# Altium schematic sheet M2maleDouble_M2female.SchDoc
size A4; SheetNumber: 1; SheetTotal: 1
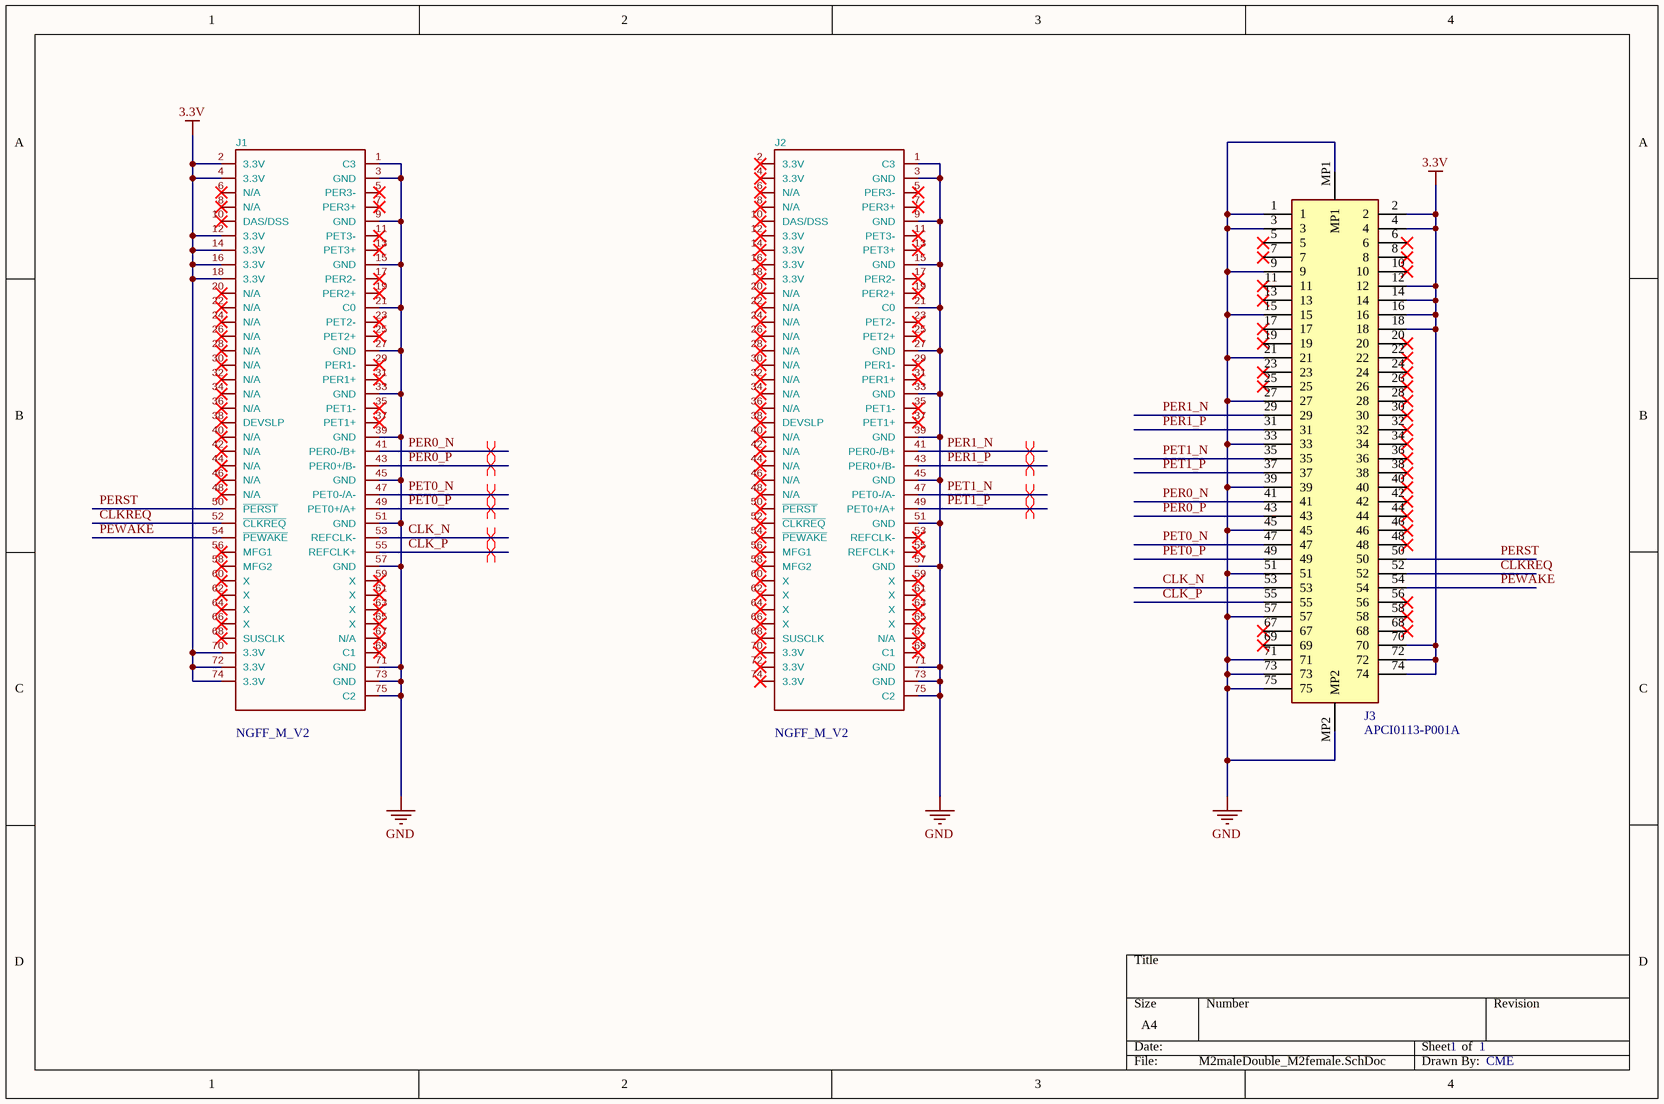
[diagram p0: M2maleDouble_M2female.SchDoc]

## Parts
J1  NGFF_M_V2  [M.2-M-KEY-2280-V2]
J2  NGFF_M_V2  [M.2-M-KEY-2280-V2]
J3  APCI0113-P001A  [APCI0113P001A]

## Nets
3.3V: J1.2(3.3V) J1.4(3.3V) J1.12(3.3V) J1.14(3.3V) J1.16(3.3V) J1.18(3.3V) J1.70(3.3V) J1.72(3.3V) J1.74(3.3V) J3.2 J3.4 J3.12 J3.14 J3.16 J3.18 J3.70 J3.72 J3.74
GND: J1.1(C3) J1.3(GND) J1.9(GND) J1.15(GND) J1.21(C0) J1.27(GND) J1.33(GND) J1.39(GND) J1.45(GND) J1.51(GND) J1.57(GND) J1.71(GND) J1.73(GND) J1.75(C2) J2.1(C3) J2.3(GND) J2.9(GND) J2.15(GND) J2.21(C0) J2.27(GND) J2.33(GND) J2.39(GND) J2.45(GND) J2.51(GND) J2.57(GND) J2.71(GND) J2.73(GND) J2.75(C2) J3.1 J3.3 J3.9 J3.15 J3.21 J3.27 J3.33 J3.39 J3.45 J3.51 J3.57 J3.71 J3.73 J3.75 J3.MP1 J3.MP2
CLK_N: J1.53(REFCLK-) J3.53
CLK_P: J1.55(REFCLK+) J3.55
CLKREQ: J1.52(~{CLKREQ}) J3.52
PER0_N: J1.41(PER0-/B+) J3.41
PER0_P: J1.43(PER0+/B-) J3.43
PER1_N: J2.41(PER0-/B+) J3.29
PER1_P: J2.43(PER0+/B-) J3.31
PERST: J1.50(~{PERST}) J3.50
PET0_N: J1.47(PET0-/A-) J3.47
PET0_P: J1.49(PET0+/A+) J3.49
PET1_N: J2.47(PET0-/A-) J3.35
PET1_P: J2.49(PET0+/A+) J3.37
PEWAKE: J1.54(~{PEWAKE}) J3.54

Not connected (* = marked no-connect by the designer): J1 5(PER3-)* 6(N/A)* 7(PER3+)* 8(N/A)* 10(DAS/DSS)* 11(PET3-)* 13(PET3+)* 17(PER2-)* 19(PER2+)* 20(N/A)* 22(N/A)* 23(PET2-)* 24(N/A)* 25(PET2+)* 26(N/A)* 28(N/A)* 29(PER1-)* 30(N/A)* 31(PER1+)* 32(N/A)* 34(N/A)* 35(PET1-)* 36(N/A)* 37(PET1+)* 38(DEVSLP)* 40(N/A)* 42(N/A)* 44(N/A)* 46(N/A)* 48(N/A)* 56(MFG1)* 58(MFG2)* 59(X)* 60(X)* 61(X)* 62(X)* 63(X)* 64(X)* 65(X)* 66(X)* 67(N/A)* 68(SUSCLK)* 69(C1)*; J2 2(3.3V)* 4(3.3V)* 5(PER3-)* 6(N/A)* 7(PER3+)* 8(N/A)* 10(DAS/DSS)* 11(PET3-)* 12(3.3V)* 13(PET3+)* 14(3.3V)* 16(3.3V)* 17(PER2-)* 18(3.3V)* 19(PER2+)* 20(N/A)* 22(N/A)* 23(PET2-)* 24(N/A)* 25(PET2+)* 26(N/A)* 28(N/A)* 29(PER1-)* 30(N/A)* 31(PER1+)* 32(N/A)* 34(N/A)* 35(PET1-)* 36(N/A)* 37(PET1+)* 38(DEVSLP)* 40(N/A)* 42(N/A)* 44(N/A)* 46(N/A)* 48(N/A)* 50(~{PERST})* 52(~{CLKREQ})* 53(REFCLK-)* 54(~{PEWAKE})* 55(REFCLK+)* 56(MFG1)* 58(MFG2)* 59(X)* 60(X)* 61(X)* 62(X)* 63(X)* 64(X)* 65(X)* 66(X)* 67(N/A)* 68(SUSCLK)* 69(C1)* 70(3.3V)* 72(3.3V)* 74(3.3V)*; J3 5* 6* 7* 8* 10* 11* 13* 17* 19* 20* 22* 23* 24* 25* 26* 28* 30* 32* 34* 36* 38* 40* 42* 44* 46* 48* 56* 58* 67* 68* 69*

## Layout directives
differential pair: CLK_N, CLK_P, PER0_N, PER0_P, PER1_N, PER1_P, PET0_N, PET0_P, PET1_N, PET1_P

## Notes on the sheet
- 1
- CME

## Library data of the parts
J3 = APCI0113-P001A: Connector; Manufacturer_Name: LOTES; Datasheet Link: https://www.lcsc.com/datasheet/lcsc_datasheet_2010161204_LOTES-APCI0113-P001A_C841669.pdf; Height: 4.8mm; Manufacturer_Part_Number: APCI0113-P001A